# EAGLE design RFM69-Gateway-logger (EAGLE 8.2.1)
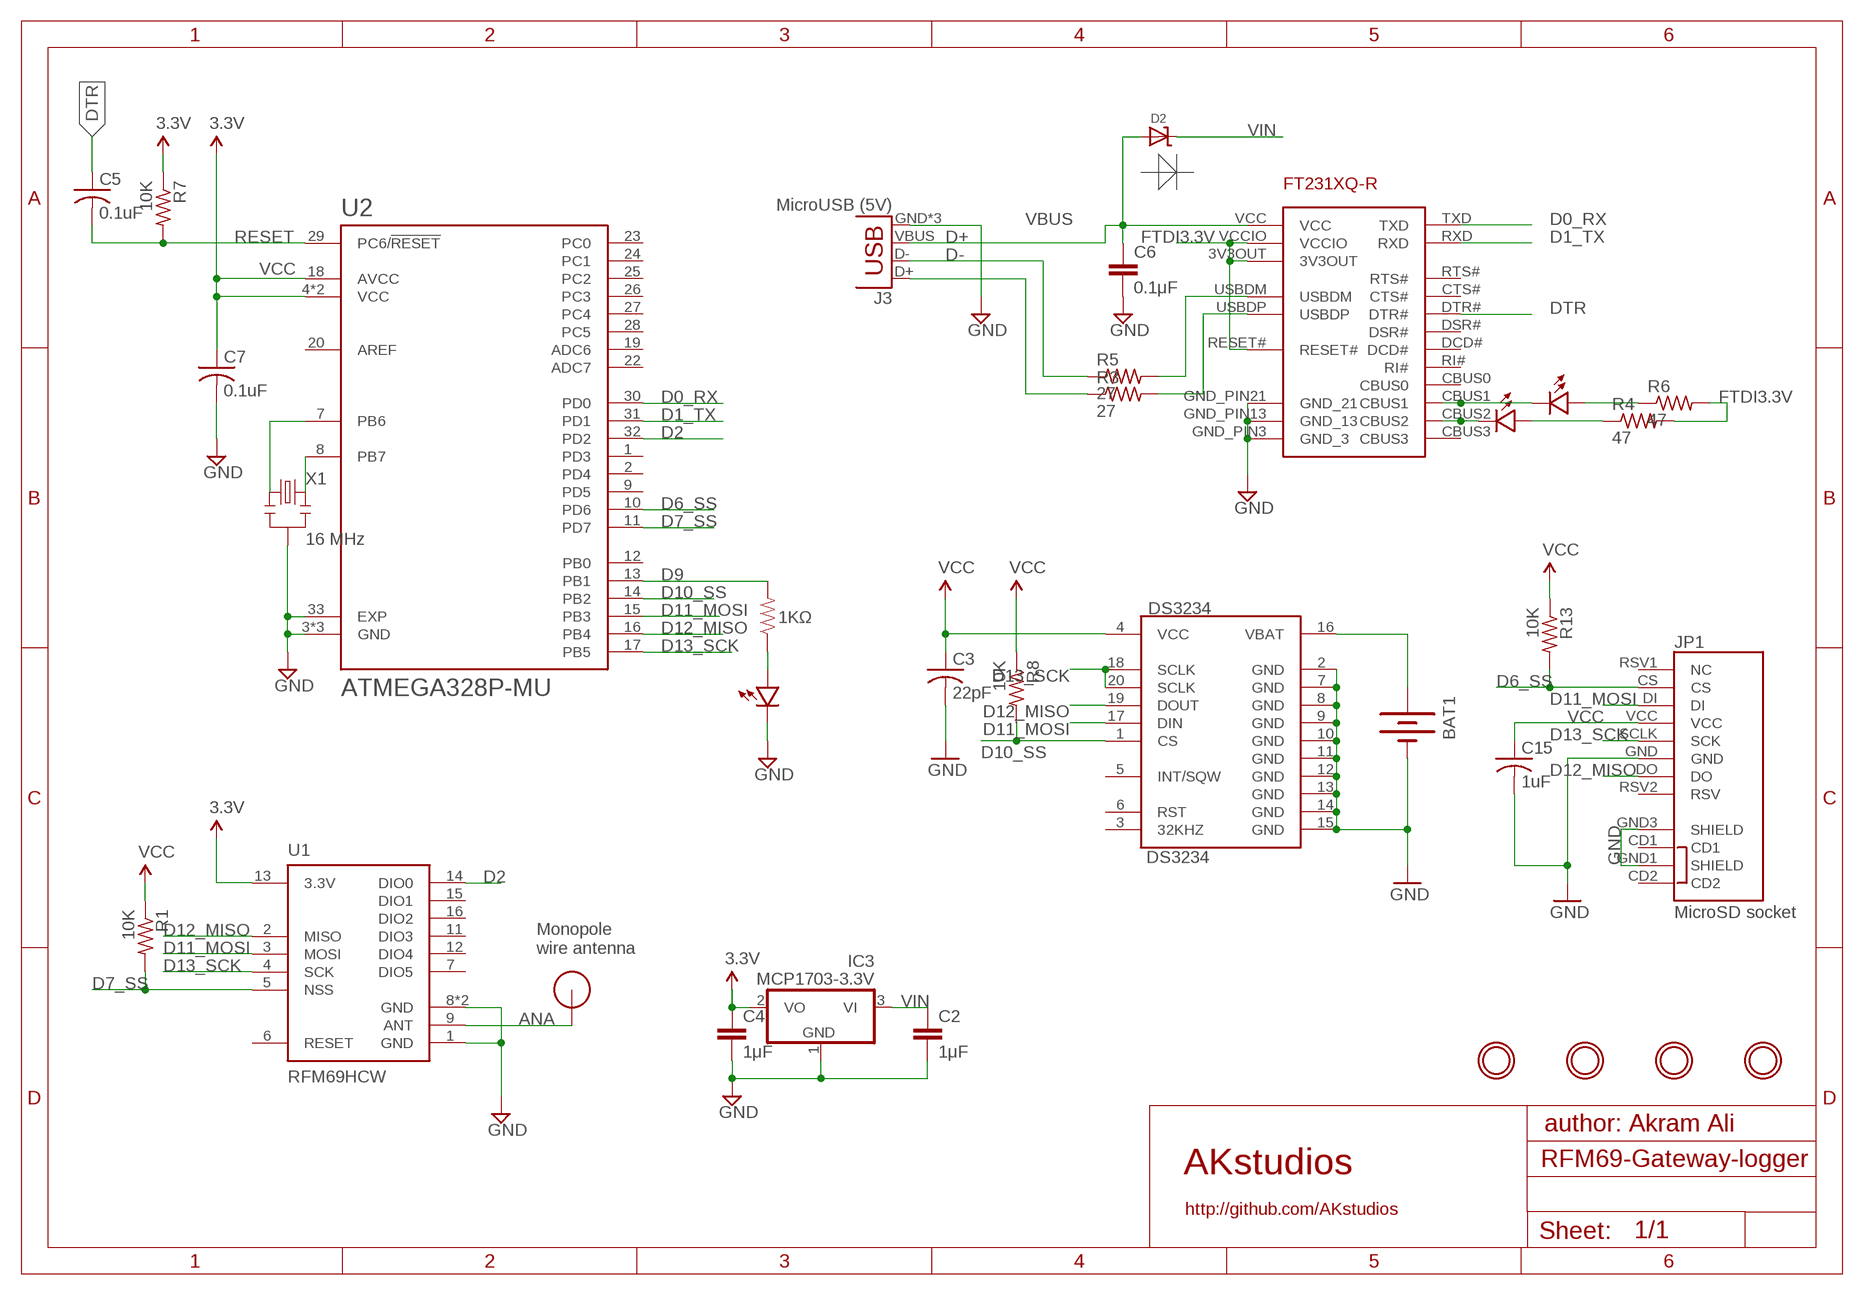
[diagram p0: schematic, sheet 1]

## Parts
BAT1  BATTERY12MM  [BATTCON_12MM]
C2  1μF  CAP0805  [0805]
C3  22pF  C-USC0402  [C0402]
C4  1μF  CAP0805  [0805]
C5  0.1uF  C-USC0402  [C0402]
C6  0.1μF  CAP0805  [0805]
C7  0.1uF  C-USC0402  [C0402]
C15  1uF  C-USC0402  [C0402]
D2  MICROBUILDER_DIODE-SCHOTTKYSOD-123  [MICROBUILDER_SOD-123]
DS3234  DS3234  [DS3234]
FT231XQ-R  FT231XQ-R  [FTDI_FT231XQ-R_PACKAGE]
IC3  MCP1703-3.3V  MCP1703CB  [SOT23]
J3  MicroUSB (5V)  USB-MICROB  [USB-MICROB]
JP1  MicroSD socket  USD-SOCKETNEW  [MICRO-SD-SOCKET-PP]
R1  10K  R-US_R0402  [R0402]
R2  1KΩ  RESISTOR0805-RES  [0805]
R3  27  R-US_R0402  [R0402]
R4  47  R-US_R0402  [R0402]
R5  27  R-US_R0402  [R0402]
R6  47  R-US_R0402  [R0402]
R7  10K  R-US_R0402  [R0402]
R8  10K  R-US_R0402  [R0402]
R13  10K  R-US_R0402  [R0402]
RX  Green  LED0805  [0805-LED]
TX  Red  LED0805  [0805-LED]
U1  RFM69HCW  [RFM69HCW-XXXS2]
U2  ATMEGA328P-MU  [QFN50P500X500X100-33N]
U$1  MOUNTINGHOLE2.0  [MOUNTINGHOLE_2.0_PLATED]
U$2  Status  LED0805  [0805-LED]
U$5  MOUNTINGHOLE2.0  [MOUNTINGHOLE_2.0_PLATED]
U$6  RFM12B_ANTENNA  [RFM12B-ANTENNA]
U$7  MOUNTINGHOLE2.0  [MOUNTINGHOLE_2.0_PLATED]
U$8  MOUNTINGHOLE2.0  [MOUNTINGHOLE_2.0_PLATED]
X1  16 MHz  RESONATORSMD  [RESONATOR-SMD]

## Nets
ANA: U1.9(ANT) U$6.P$1
D0_RX: FT231XQ-R.TXD U2.30(PD0)
D1_TX: FT231XQ-R.RXD U2.31(PD1)
D2: U1.14(DIO0) U2.32(PD2)
D6_SS: JP1.CS R13.2 U2.10(PD6)
D7_SS: R1.2 U1.5(NSS) U2.11(PD7)
D9: R2.2 U2.13(PB1)
D10_SS: DS3234.1(CS) R8.2 U2.14(PB2)
D11_MOSI: DS3234.17(DIN) JP1.DI U1.3(MOSI) U2.15(PB3)
D12_MISO: DS3234.19(DOUT) JP1.DO U1.2(MISO) U2.16(PB4)
D13_SCK: DS3234.18(SCLK) DS3234.20(SCLK) JP1.SCLK(SCK) U1.4(SCK) U2.17(PB5)
D+: J3.D+ R3.1
D-: J3.D- R5.1
DTR: C5.1 FT231XQ-R.DTR#
FTDI3.3V: FT231XQ-R.3V3OUT FT231XQ-R.RESET# FT231XQ-R.VCCIO R4.2 R6.2
GND [power]: BAT1.GND(-) C2.2 C3.2 C4.2 C6.2 C7.2 C15.2 DS3234.2(GND) DS3234.7(GND) DS3234.8(GND) DS3234.9(GND) DS3234.10(GND) DS3234.11(GND) DS3234.12(GND) DS3234.13(GND) DS3234.14(GND) DS3234.15(GND) FT231XQ-R.GND_PIN3(GND_3) FT231XQ-R.GND_PIN13(GND_13) FT231XQ-R.GND_PIN21(GND_21) IC3.1(GND) J3.GND J3.MT1(GND) J3.MT2(GND) JP1.GND JP1.GND1(SHIELD) JP1.GND3(SHIELD) U1.1(GND) U1.8(GND) U1.10(GND) U2.3(GND) U2.5(GND) U2.21(GND) U2.33(EXP) U$2.MINUS X1.2
N$1: U2.7(PB6) X1.1
N$2: R2.1 U$2.PLUS
N$3: BAT1.PWR@1(+) DS3234.16(VBAT)
N$4: FT231XQ-R.USBDM R5.2
N$5: FT231XQ-R.USBDP R3.2
N$6: FT231XQ-R.CBUS1 RX.MINUS
N$7: FT231XQ-R.CBUS2 TX.MINUS
N$8: R4.1 TX.PLUS
N$9: R6.1 RX.PLUS
N$21: U2.8(PB7) X1.3
RESET: C5.2 R7.2 U2.29(PC6/!RESET)
VBUS [power]: C6.1 D2.A FT231XQ-R.VCC J3.VBUS
VCC: C3.1 C4.1 C7.1 C15.1 DS3234.4(VCC) IC3.2(VO) JP1.VCC R1.1 R7.1 R8.1 R13.1 U1.13(3.3V) U2.4(VCC) U2.6(VCC) U2.18(AVCC) ; supply symbol labelled 3.3V
VIN: C2.1 D2.C IC3.3(VI)
Unconnected: DS3234.3(32KHZ) DS3234.5(INT/SQW) DS3234.6(RST) FT231XQ-R.CBUS0 FT231XQ-R.CBUS3 FT231XQ-R.CTS# FT231XQ-R.DCD# FT231XQ-R.DSR# FT231XQ-R.RI# FT231XQ-R.RTS# JP1.CD1 JP1.CD2 JP1.RSV1(NC) JP1.RSV2(RSV) U1.6(RESET) U1.7(DIO5) U1.11(DIO3) U1.12(DIO4) U1.15(DIO1) U1.16(DIO2) U2.1(PD3) U2.2(PD4) U2.9(PD5) U2.12(PB0) U2.19(ADC6) U2.20(AREF) U2.22(ADC7) U2.23(PC0) U2.24(PC1) U2.25(PC2) U2.26(PC3) U2.27(PC4) U2.28(PC5)

## Notes on the sheet
- Monopole
  wire antenna
- author: Akram Ali
- AKstudios
- http://github.com/AKstudios

## Library data of the parts
BAT1 = SparkFun-Electromechanical:BATTERY: Battery Holders Various common sizes : AA, AAA, 18650 (PRT-12895), 20mm coin cell and 12mm coin cell. 20MM_4LEGS, BATT-10373; MPN: 3000; PROD_ID: BATT-08044
C2 = SparkFun:CAP: Capacitor Standard 0603 ceramic capacitor, and 0.1" leaded capacitor.; MPN: CC0805ZRY5V8BB105
C3 C5 C7 C15 = adafruit:C-US: CAPACITOR, American symbol
C4 = LowPowerLab:CAP: Capacitor Standard 0603 ceramic capacitor, and 0.1" leaded capacitor.; MPN: CC0805ZRY5V8BB105
C6 = SparkFun:CAP: Capacitor Standard 0603 ceramic capacitor, and 0.1" leaded capacitor.; MPN: CC0805KRX7R9BB104
D2 = Adafruit Feather 32u4 Bluefruit LE:MICROBUILDER_DIODE-SCHOTTKY
DS3234 = SparkFun-FreqCtrl:DS3234: SPI RTC module with battery backup and internal clock.; MPN: DS3234S#
FT231XQ-R = ftdi_ft231xq-r:FT231XQ-R: This is the 20-LD QFN package of the FTDI FT231XQ-R chip.; MPN: FT231XQ-R
IC3 = linear:MCP1703: 250 mA, 16V, Low Quiescent Current LDO Regulator Source: http://ww1.microchip.com/downloads/en/DeviceDoc/22049b.pdf; MPN: MCP1703T-2502E/CB
J3 = SparkFun-Connectors:USB: USB Connectors USB-B-PTH is fully proven SKU : PRT-00139/CONN-08278 USB-miniB is fully proven SKU : PRT-00587 USB-A-PCB is untested. USB-A-H is throughly reviewed, but untested. Spark Fun Electronics SKU : PRT-00437 USB-B-SMT is throughly reviewed, but untested. Needs silkscreen touching up. USB-A-S has not been used/tested USB-MB-H has not been used/tested USB-MICROB has been used. CONN-09505; MPN: CONN-09505; PROD_ID: CONN-09505
JP1 = SparkFun-Connectors:USD-SOCKET: microSD Socket Push-push type uSD socket. Schematic element and footprint production proven. Spark Fun Electronics SKU : PRT-00127. tDoc lines correctly indicate media card edge positions when inserting (unlocked, locked, depressed). NOTE: CD1 and CD2 are connected internally; PROD_ID: CONN-07820
R1 R3-R8 R13 = adafruit:R-US_: RESISTOR, American symbol
R2 = SparkFun:RESISTOR: Resistor Basic schematic elements and footprints for 0603, 1206, and PTH resistors.; MPN: RC0805FR-071KL
RX TX U$2 = LowPowerLab:LED; MPN: LG R971-KN-1
U1 = SparkFun-RF:RFM69H; MPN: RFM69HW; PROD_ID: IC-11997, IC-12053
U2 = ATMEGA328P-MU:ATMEGA328P-MU: ATmega Series 20 MHz 32 KB Flash 2 KB SRAM 8-Bit Microcontroller - QFN-32; AVAILABILITY: Good; DESCRIPTION: ATmega Series 20 MHz 32 KB Flash 2 KB SRAM 8-Bit Microcontroller - QFN-32; MF: Atmel; MP: ATMEGA328P-MU; MPN: ATmega328P-MU; PACKAGE: QFN-32 Atmel; PRICE: 2.55 USD
U$1 U$5 U$7 U$8 = ADS1x15:MOUNTINGHOLE: Mounting Hole For #2 screws (0.086"/2.18mm width, 0.094"/2.4mm hole) use 2.5mm
U$6 = LowPowerLab:RFM12B_ANTENNA
X1 = SparkFun:RESONATOR: Resonator Small SMD resonator. This is the itty bitty 10/20MHz resonators with built in caps. CSTCE10M0G55 and CSTCE20M0V53. Footprint has been reviewed closely but hasn't been tested yet.; MPN: CSTCE16M0V53-R0

## Net classes
1 power: width 0.381 mm, clearance 0.254 mm

## Board
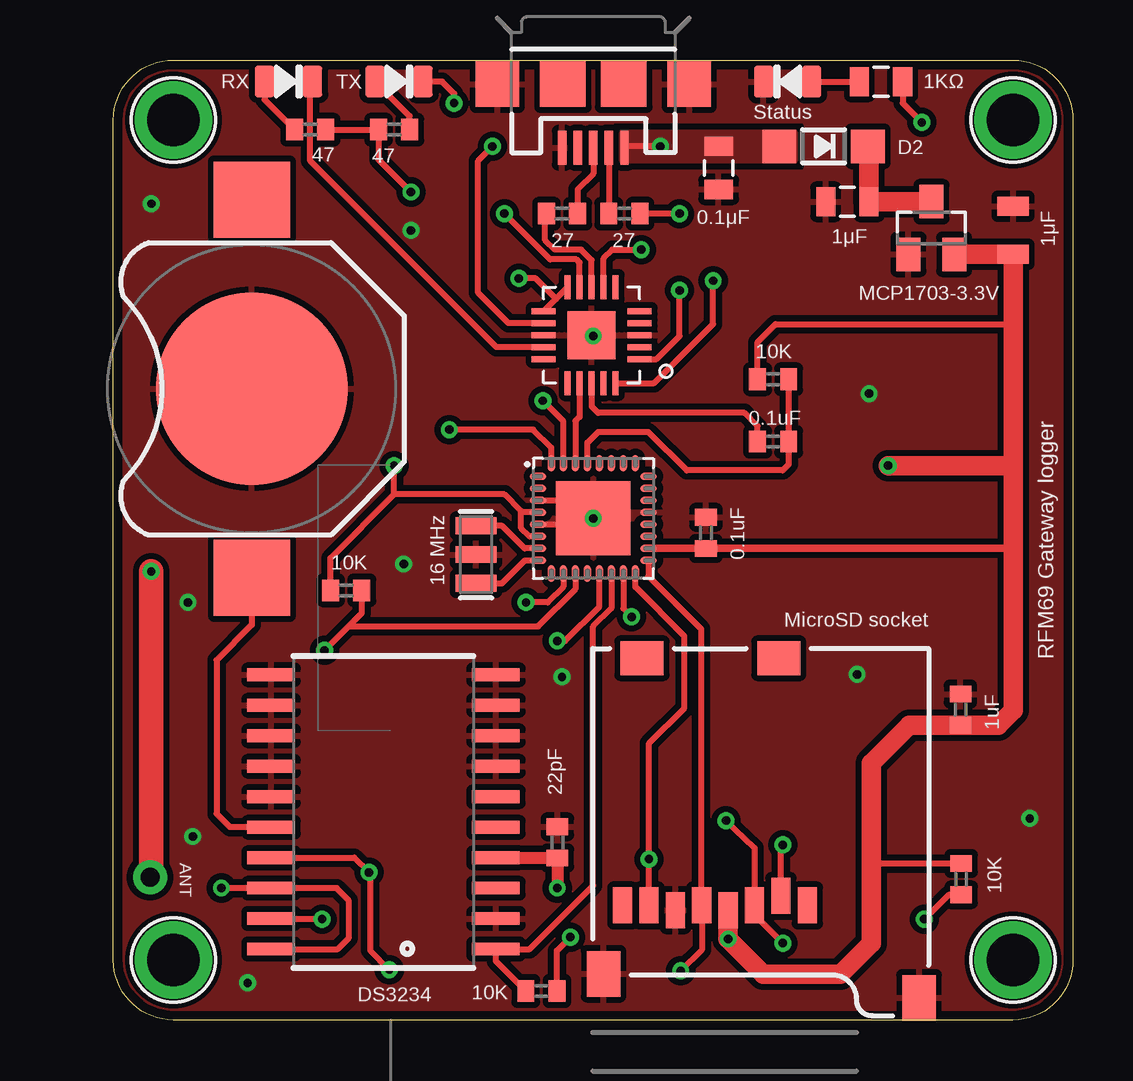
[diagram p1: board, top side]
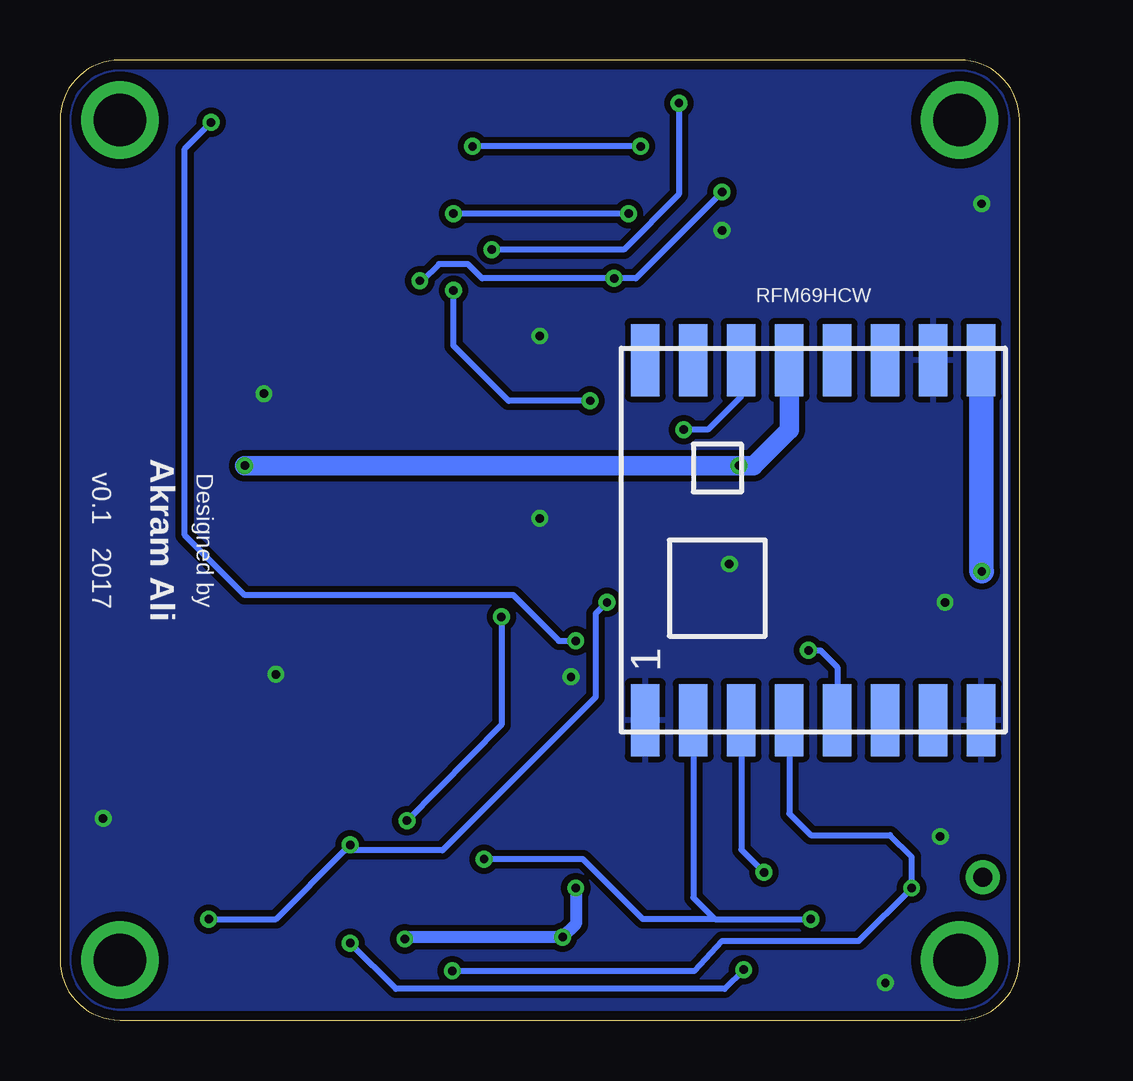
[diagram p2: board, bottom side, seen from below]

Size 40 x 40 mm. Coordinates in mm from the lower left corner, seen from the top.
Outline: 0,2.5 0,37.5 arc-90 2.5,40 37.5,40 arc-90 40,37.5 40,2.5 arc-90 37.5,0 2.5,0 arc-90 0,2.5
Copper layers (1*16): Top 0.0356mm / dielectric 1.5011mm / Bottom 0.0356mm
Design rules "oshpark-2layer": minimum track width 6mil, minimum drill 13mil, track to track 6mil, track to pad 6mil, pad to pad 6mil, via to via 6mil, smd to smd 6mil, copper to edge 15mil, drill to drill 6mil, minimum pad ring 7mil, minimum via ring 7mil, stop-mask expansion 2.5mil, vias tented up to drill 0mil, thermal gap 10mil

### Footprints (pad centres in the part's own frame; a part is rotated, then mirrored left to right if it is on the bottom)
BATTCON_12MM = smd 8 x 8: GND 0,0 | smd 3.175 x 3.175: PWR@1 -7.874,0; PWR@2 7.874,0
0805 = smd 0.8 x 1.2: 1 -0.9,0; 2 0.9,0
C0402 = smd 0.7 x 0.9: 1 -0.65,0; 2 0.65,0
0805' = smd 0.8 x 1.3: 1 -1,0; 2 1,0
MICROBUILDER_SOD-123 = smd 1.4 x 1.4: A 1.85,0; C -1.85,0
DS3234 = smd 0.53 x 1.98: 1 -5.715,-4.685; 2 -4.445,-4.685; 3 -3.175,-4.685; 4 -1.905,-4.685; 5 -0.635,-4.685; 6 0.635,-4.685; 7 1.905,-4.685; 8 3.175,-4.685; 9 4.445,-4.685; 10 5.715,-4.685; 11 5.715,4.685; 12 4.445,4.685; 13 3.175,4.685; 14 1.905,4.685; 15 0.635,4.685; 16 -0.635,4.685; 17 -1.905,4.685; 18 -3.175,4.685; 19 -4.445,4.685; 20 -5.715,4.685
FTDI_FT231XQ-R_PACKAGE = smd 0.25 x 1: 3V3OUT 0.968,-2.032; CBUS2 -0.532,-2.032; CBUS3 0.968,1.968; CTS# -1.032,-2.032; DTR# -0.032,1.968; RTS# -0.532,1.968; TXD 0.468,1.968; USBDM 0.468,-2.032; USBDP -0.032,-2.032; VCCIO -1.032,1.968 | smd 1 x 0.25: CBUS0 1.968,0.968; CBUS1 1.968,0.468; DCD# -2.032,-1.032; DSR# -2.032,-0.532; GND_PIN3 -2.032,-0.032; GND_PIN13 1.968,-0.032; RESET# 1.968,-1.032; RI# -2.032,0.468; RXD -2.032,0.968; VCC 1.968,-0.532 | smd 2 x 2: GND_PIN21 -0.032,-0.032
SOT23 = smd 1 x 1.4: 1 -0.95,-1.1; 2 0.95,-1.1; 3 0,1.1
USB-MICROB = smd 0.35 x 1.4: D+ 0,2.65; D- -0.65,2.65; GND 1.3,2.65; ID 0.65,2.65; VBUS -1.3,2.65 | smd 1.8 x 1.9: MT1 -4,0; MT2 4,0 | smd 1.9 x 1.9: P$1 -1.27,0; P$2 1.27,0
MICRO-SD-SOCKET-PP = smd 1.8 x 1.4: CD1 -2.05,0.4; CD2 -7.75,0.4 | smd 0.8 x 1.5: CS -7.84,10.3; DI -6.74,10.7; DO -2.34,10.7; GND -3.44,10.9; RSV1 -8.94,10.7; RSV2 -1.24,10.7; SCLK -4.54,10.7; VCC -5.64,10.9 | smd 1.4 x 1.9: GND1 -13.6,14.55; GND3 -0.45,13.55
R0402 = smd 0.7 x 0.9: 1 -0.65,0; 2 0.65,0
0805-LED = smd 0.8 x 1.3: MINUS -1,0; PLUS 1,0
RFM69HCW-XXXS2 = smd 3 x 1.2: 1 -7.5,7; 2 -7.5,5; 3 -7.5,3; 4 -7.5,1; 5 -7.5,-1; 6 -7.5,-3; 7 -7.5,-5; 8 -7.5,-7; 9 7.5,-7; 10 7.5,-5; 11 7.5,-3; 12 7.5,-1; 13 7.5,1; 14 7.5,3; 15 7.5,5; 16 7.5,7
QFN50P500X500X100-33N = smd 0.7 x 0.3: 1 -2.3,1.75; 2 -2.3,1.25; 3 -2.3,0.75; 4 -2.3,0.25; 5 -2.3,-0.25; 6 -2.3,-0.75; 7 -2.3,-1.25; 8 -2.3,-1.75; 17 2.3,-1.75; 18 2.3,-1.25; 19 2.3,-0.75; 20 2.3,-0.25; 21 2.3,0.25; 22 2.3,0.75; 23 2.3,1.25; 24 2.3,1.75 | smd 0.3 x 0.7: 9 -1.75,-2.3; 10 -1.25,-2.3; 11 -0.75,-2.3; 12 -0.25,-2.3; 13 0.25,-2.3; 14 0.75,-2.3; 15 1.25,-2.3; 16 1.75,-2.3; 25 1.75,2.3; 26 1.25,2.3; 27 0.75,2.3; 28 0.25,2.3; 29 -0.25,2.3; 30 -0.75,2.3; 31 -1.25,2.3; 32 -1.75,2.3 | smd 3.1 x 3.1: 33 0,0
MOUNTINGHOLE_2.0_PLATED = drill 2.2 pad 3: P$1 0,0
RFM12B-ANTENNA = drill 0.8 pad 1.422: P$1 0,0
RESONATOR-SMD = smd 0.7 x 1.7: 1 -1.2,0; 2 0,0; 3 1.2,0

### Placement (x,y rotation side)
BAT1  5.77,26.3 90 top
C2  30.6,34.1 180 top
C3  18.51,7.4 90 top
C4  1μF  [0805']  37.5,32.9 90 top
C5  27.5,24.1 0 top
C6  25.23,35.5 270 top
C7  24.7,20.3 90 top
C15  35.31,12.93 90 top
D2  29.6,36.4 180 top
DS3234  11.26,8.67 90 top
FT231XQ-R  19.9,28.5 180 top
IC3  34.1,33 0 top
J3  20,39 180 top
JP1  19.98,15.47 180 top
R1  9.7,17.9 0 top
R2  32,39.09 0 top
R3  18.7,33.6 180 top
R4  11.7,37.1 180 top
R5  21.3,33.6 0 top
R6  8.2,37.1 0 top
R7  27.5,26.7 0 top
R8  17.84,1.21 180 top
R13  35.34,5.87 270 top
RX  7.3,39.1 180 top
TX  11.9,39.1 180 top
U1  8.6,20 90 bottom
U2  20,20.9 0 top
U$1  37.5,37.5 0 top
U$2  28.1,39.1 0 top
U$5  2.5,37.5 0 top
U$6  1.53,5.95 0 top
U$7  37.5,2.5 0 top
U$8  2.5,2.5 0 top
X1  15.12,19.39 270 top

### Tracks (layer width: path | path; a pad name or v marks a point on that pad's centre or on a via)
ANA  (via drill 0.35 pad 0.13)
  Top 1.016: v1.57,18.69 1.57,6 U$6.P$1
  Bottom 1.016: U1.9 1.6,18.72 v1.57,18.69
D0_RX
  Top 0.254: 19.25,24.95 U2.30 | 19.25,24.95 19.3,25 | FT231XQ-R.TXD 19.43,25.13 19.25,24.95
D1_TX  (via drill 0.35 pad 0.13)
  Top 0.254: U2.31 18.75,24.95 v17.9,25.8 | FT231XQ-R.RXD 22.64,27.54 23.6,28.5 v23.6,30.4
  Bottom 0.254: v23.6,30.4 23.6,28.1 21.3,25.8 v17.9,25.8
D2  (via drill 0.35 pad 0.13)
  Top 0.254: U2.32 18.25,23.85 17.5,24.6 v14,24.6
  Bottom 0.254: v14,24.6 13,24.6 11.6,26 U1.14
D6_SS  (via drill 0.35 pad 0.13)
  Top 0.254: R13.2 34.82,5.22 v33.8,4.2 | JP1.CS 27.82,7.22 v27.9,7.3 | U2.10 18.75,18.05 18.1,17.4 v17.2,17.4
  Bottom 0.254: v33.8,4.2 31,4.2 28.15,7.05 | 28.15,7.05 v27.9,7.3 | 28.15,7.05 28.13,7.07 24.06,7.07 17.67,13.46 17.67,16.93 v17.2,17.4
D7_SS  (via drill 0.35 pad 0.13)
  Top 0.254: U2.11 19.25,17.95 17.7,16.4 9.8,16.4 | v8.8,15.4 9.8,16.4 | R1.2 10.35,16.95 9.8,16.4
  Bottom 0.254: v8.8,15.4 8.3,15.4 7.6,14.7 U1.5
D9  (via drill 0.35 pad 0.13)
  Top 0.254: U2.13 20.25,17.23 18.82,15.8 v18.5,15.8 | R2.2 32.9,38.2 v33.7,37.4
  Bottom 0.254: v33.7,37.4 34.8,36.3 34.8,20.2 32.3,17.7 21.1,17.7 19.2,15.8 v18.5,15.8
D10_SS
  Top 0.254: U2.14 20.75,17.15 20,16.4 20,5.6 17.36,2.96 DS3234.1 15.94,2.45 R8.2
D11_MOSI  (via drill 0.35 pad 0.13)
  Top 0.254: U2.15 21.25,17.15 v21.6,16.8 | v25.54,8.31 26.73,7.17 JP1.DI 26.73,4.38 v27.9,3.2 | DS3234.17 10.04,6.76 v10.65,6.15 10.7,6.1 10.7,2.9 v11.5,2.1
  Bottom 0.254: v11.5,2.1 12.3,1.3 26,1.3 v27.9,3.2 | U1.3 11.6,7.1 v10.65,6.15 | v21.6,16.8 21.6,12.3 v25.54,8.31
D12_MISO  (via drill 0.35 pad 0.13)
  Top 0.254: U2.16 21.75,18.05 23.8,16 23.8,13 22.32,11.53 v22.32,6.7 JP1.DO | DS3234.19 8.68,4.22 v8.7,4.2
  Bottom 0.254: 12.7,4.2 v8.7,4.2 | 12.7,4.2 15.7,4.2 18.2,6.7 v22.32,6.7 | U1.2 13.6,5.1 12.7,4.2
D13_SCK  (via drill 0.35 pad 0.13)
  Top 0.254: U2.17 22.3,18.5 24.5,16.3 24.5,4.8 JP1.SCLK 24.52,2.92 v23.65,2.05 | DS3234.20 9.36,2.96 9.8,3.4 9.8,5 9.3,5.5 DS3234.18 v4.5,5.5
  Bottom 0.254: U1.4 9.6,8.6 8.7,7.7 5.4,7.7 4.5,6.8 v4.5,5.5 6.7,3.3 12.4,3.3 13.55,2.05 v23.65,2.05
D+
  Top 0.254: J3.D+ 20,35.26 19.35,34.61 R3.1
D-
  Top 0.254: J3.D- R5.1
DTR
  Top 0.254: FT231XQ-R.DTR# 19.93,25.57 20.2,25.3 26.3,25.3 26.85,24.75 C5.1
FTDI3.3V  (via drill 0.35 pad 0.13)
  Top 0.254: 18.45,30.05 FT231XQ-R.RESET# | 18.45,30.05 FT231XQ-R.3V3OUT | 18.45,30.05 17.6,30.9 v16.9,30.9 | R6.2 R4.2 11.05,35.85 v12.4,34.5 | FT231XQ-R.VCCIO 22.54,26.54 25,29 v25,30.8
  Bottom 0.254: v12.4,34.5 16,30.9 v16.9,30.9 22.4,30.9 23,31.5 24.2,31.5 24.9,30.8 v25,30.8
GND  (via drill 0.35 pad 0.13)
  Top 0.254: U2.3 19.25,21.66 U2.33 | U2.5 19.75,20.66 U2.33
  other vias: 12.4,32.9 20,20.9 20,28.5 38.2,8.4 31,14.4 12.1,19 18.7,14.3 31.5,26.1 3.31,7.65 5.59,1.55 3.1,17.4 1.58,34.01
  pour Top (rank 6): 0,0 40,0 40,40 0,40
  pour Bottom (rank 6): -0.5,-0.5 40.5,-0.5 40.5,40.5 -0.5,40.5
N$1
  Top 0.254: X1.1 16.21,20.59 17.14,19.66 U2.7
N$2
  Top 0.254: U$2.PLUS 31.09,39.1 R2.1
N$3
  Top 0.254: DS3234.16 4.87,8.04 4.3,8.6 4.3,15 5.77,16.47 BAT1.PWR@1
N$4  (via drill 0.35 pad 0.13)
  Top 0.254: FT231XQ-R.USBDM 19.43,31.56 19.3,31.69 18.21,31.69 v16.3,33.6 | v23.6,33.6 R5.2
  Bottom 0.254: v16.3,33.6 v23.6,33.6
N$5
  Top 0.254: FT231XQ-R.USBDP 19.93,31.67 19.5,32.1 18.4,32.1 18,32.5 18,33.55 R3.2
N$6
  Top 0.254: FT231XQ-R.CBUS1 15.96,28.04 8.2,35.8 8.2,39.01 RX.MINUS
N$7  (via drill 0.35 pad 0.13)
  Top 0.254: v14.2,38.2 14.2,38.6 13.7,39.1 TX.MINUS | v22,32.1 20.8,32.1 20.43,31.73 FT231XQ-R.CBUS2
  Bottom 0.254: v22,32.1 16.5,32.1 14.2,34.4 v14.2,38.2
N$8
  Top 0.254: R4.1 12.35,37.66 TX.PLUS
N$9
  Top 0.254: RX.PLUS 6.3,38.35 R6.1
N$21
  Top 0.254: U2.8 17.16,19.16 16.19,18.19 X1.3
RESET
  Top 0.254: U2.29 19.75,24.05 20.2,24.5 22.3,24.5 23.9,22.9 27.9,22.9 28.15,23.15 C5.2 R7.2
VBUS  (via drill 0.35 pad 0.13)
  Top 0.254: FT231XQ-R.VCC 16.46,29.04 15.2,30.3 15.2,35.8 v15.8,36.4 | v22.8,36.4 21.36,36.4 J3.VBUS
  Bottom 0.254: v15.8,36.4 v22.8,36.4
  pour Top (no thermals): 21.2,37 28.4,37 28.4,35.8 21.2,35.8
VCC  (via drill 0.35 pad 0.13)
  Top 0.254: U2.6 17.34,20.16 17,20.5 17,21.1 | U2.4 17.05,21.16 17,21.1 | 17,21.1 17,21.2 16.3,21.9 11.7,21.9 | R7.1 26.85,28.25 27.6,29 37.2,29 37.5,28.7 | R13.1 31.78,6.52 31.6,6.7 | R8.1 18.49,2.89 v19.05,3.45 | R1.1 9.05,19.25 11.7,21.9 | 11.7,21.9 v11.7,23.1
  Top 0.305: U2.18 C7.1 37.35,19.65 37.5,19.5
  Top 0.508: DS3234.4 18.49,6.76 C3.1 v18.51,5.51 v18.5,5.5 | 25.6,4.55 JP1.VCC
  Top 0.813: IC3.2 C4.1 37.5,28.7 37.5,23.1 | 37.5,23.1 37.5,19.5 37.5,12.9 36.88,12.28 C15.1 33.18,12.28 31.6,10.7 31.6,6.7 31.6,3.2 30.3,1.9 27.1,1.9 v25.62,3.38 JP1.VCC | v32.3,23.1 37.5,23.1
  Bottom 0.508: v18.5,5.5 18.5,4 v19.05,3.45 25.55,3.45 v25.62,3.38
  Bottom 0.813: U1.13 9.6,24.6 11.1,23.1 v11.7,23.1 v32.3,23.1
VIN
  Top 0.813: D2.C 31.5,36.35 C2.1 IC3.3

### Text on the board
tPlace: RFM69 Gateway logger | ANT
bPlace: Designed by | Akram Ali | v0.1 2017
tDocu: All dimensions in mils | Moteino-USB